# EAGLE design TindikSapi_V1_rev (EAGLE 9.6.2)
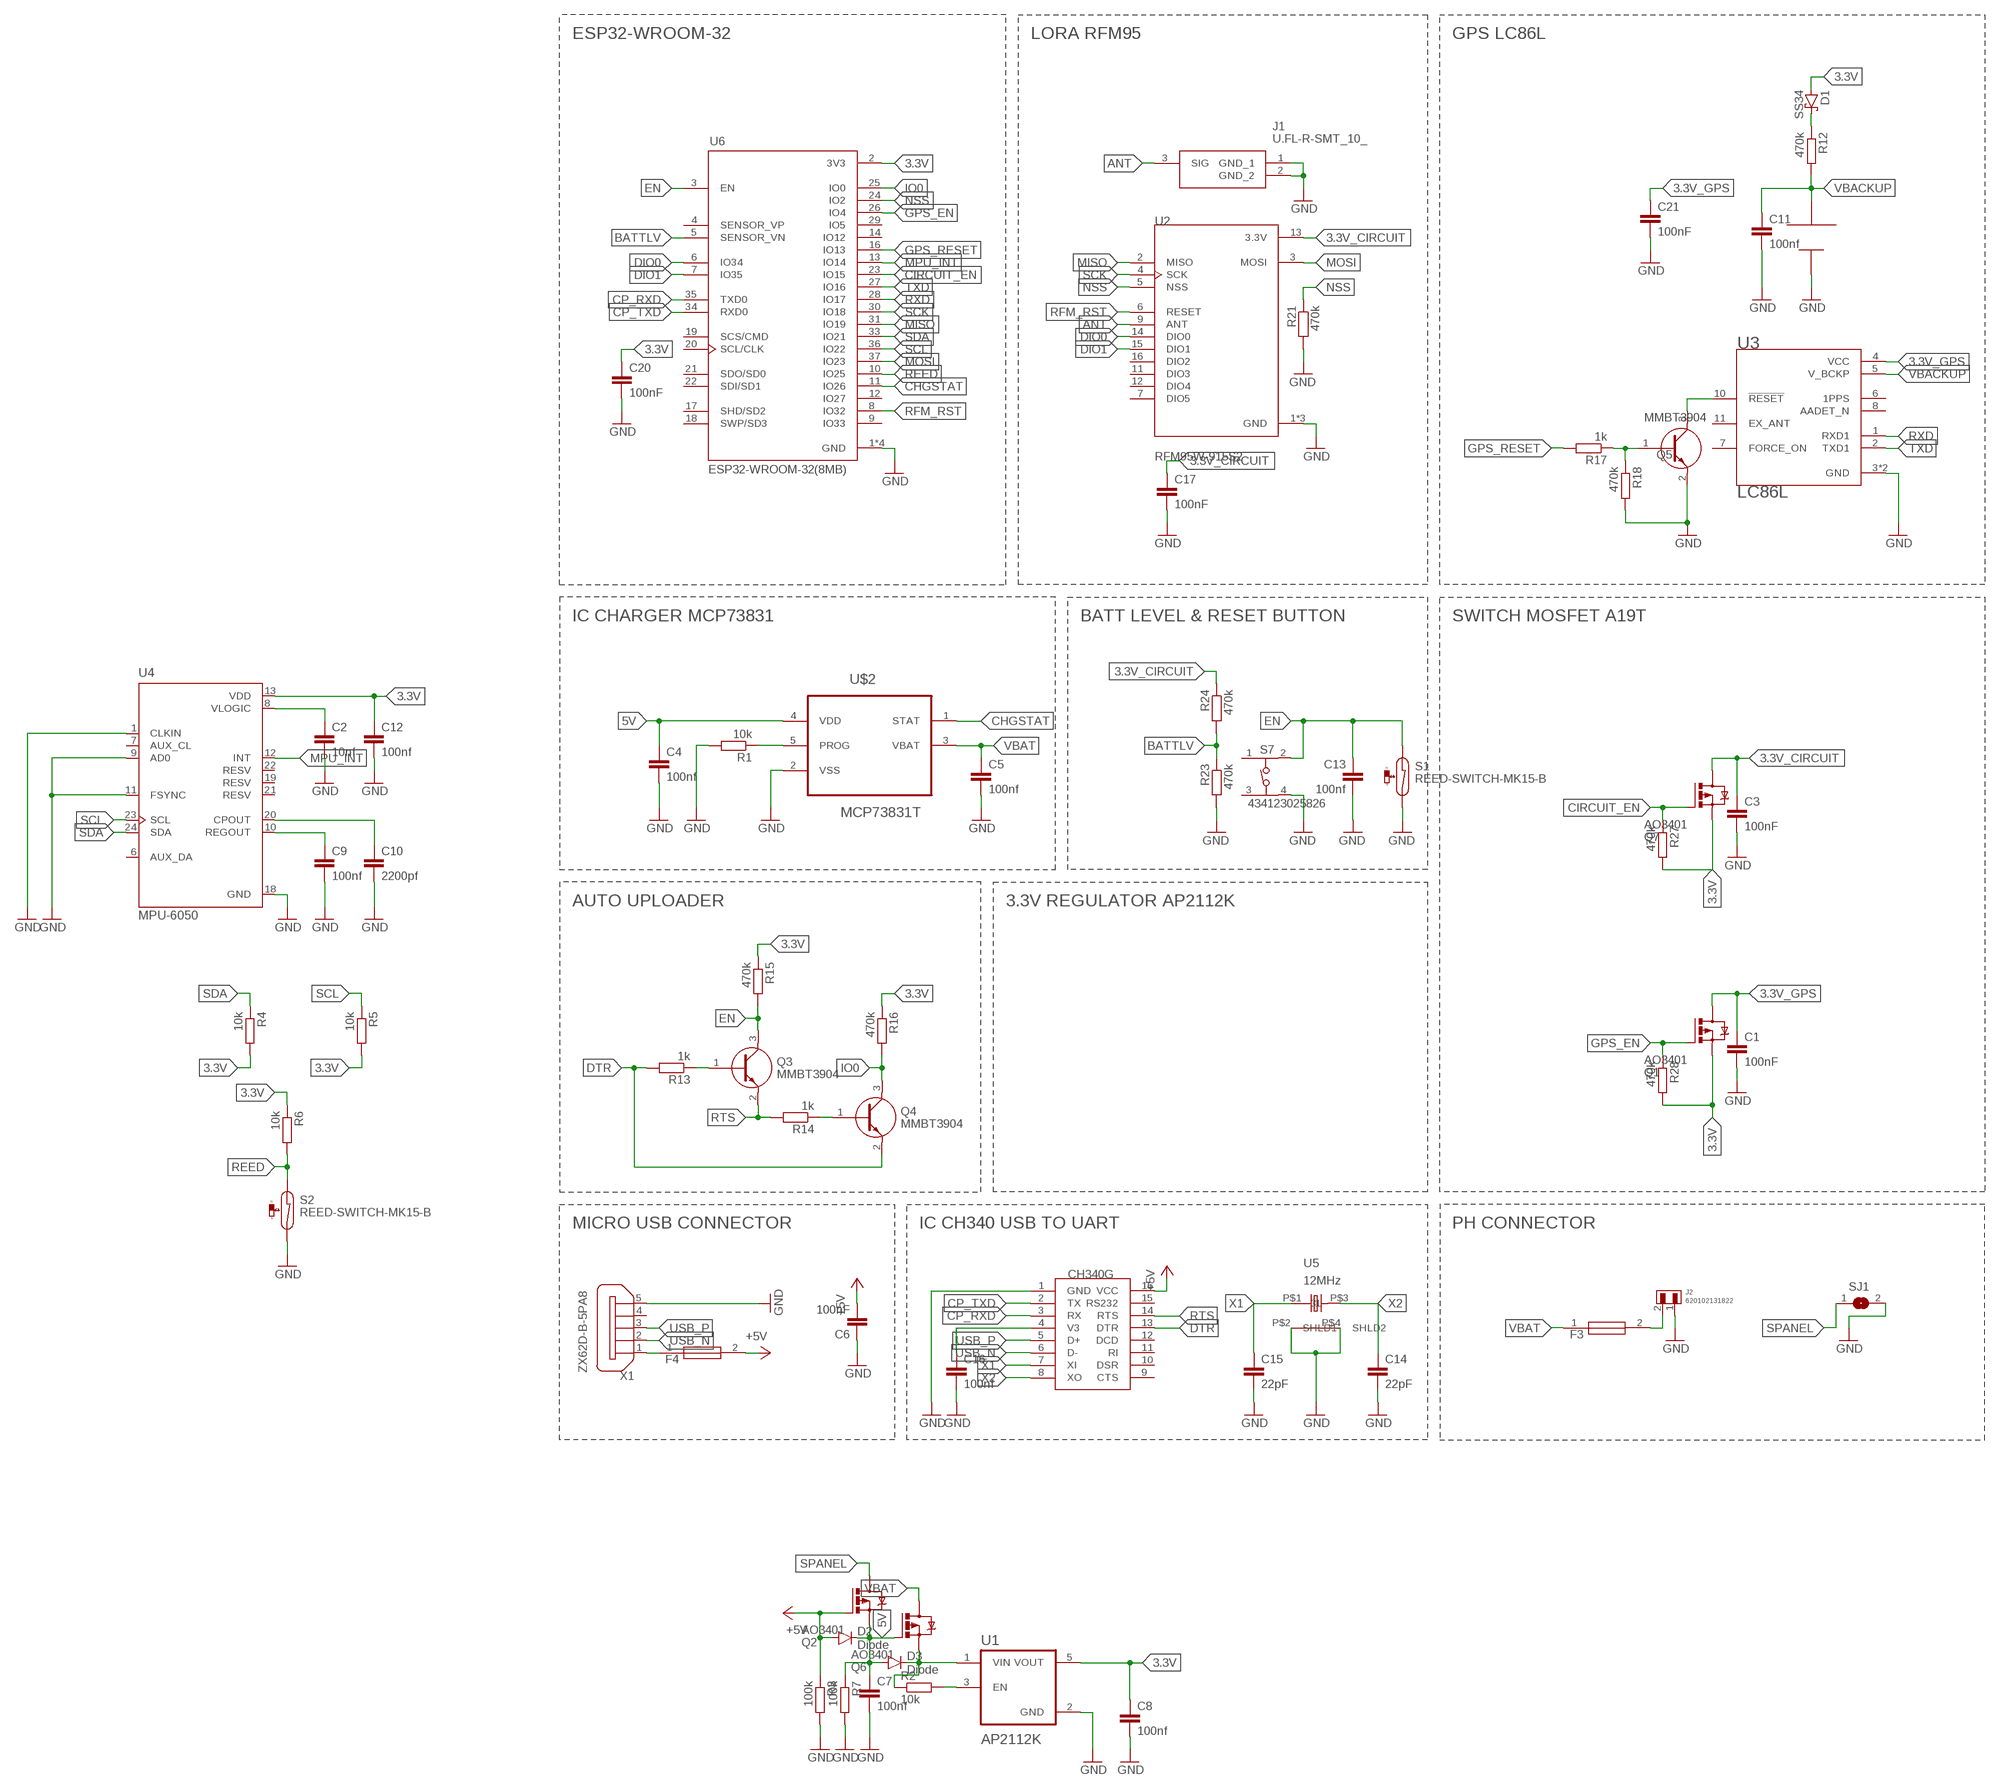
[diagram p0: schematic, sheet 1]

## Parts
C1  100nF  C-EUC0603  [C0603]
C2  10nf  C-EUC0603  [C0603]
C3  100nF  C-EUC0603  [C0603]
C4  100nf  C-EUC0603  [C0603]
C5  100nf  C-EUC0603  [C0603]
C6  100nF  C-EUC0603  [C0603]
C7  100nf  C-EUC0603  [C0603]
C8  100nf  C-EUC0603  [C0603]
C9  100nf  C-EUC0603  [C0603]
C10  2200pf  C-EUC0603  [C0603]
C11  100nf  C-EUC0603  [C0603]
C12  100nf  C-EUC0603  [C0603]
C13  100nf  C-EUC0603  [C0603]
C14  22pF  C-EUC0603  [C0603]
C15  22pF  C-EUC0603  [C0603]
C16  100nf  C-EUC0603  [C0603]
C17  100nF  C-EUC0603  [C0603]
C20  100nF  C-EUC0603  [C0603]
C21  100nF  C-EUC0603  [C0603]
D1  SS34  SS12  [SMA]
D2  Diode  DIODE-SOD123  [SOD123]
D3  Diode  DIODE-SOD123  [SOD123]
F3  FUSE 1A  MF-NSML260_12-2  [FUSC3216X100N]
F4  FUSE 1A  MF-NSML260_12-2  [FUSC3216X100N]
J1  U.FL-R-SMT_10_  [UFLRSMT10]
J2  620102131822  [620102131822]
Q1  AO3401  PMOSFET_SOT23  [SOT23]
Q2  AO3401  PMOSFET_SOT23  [SOT23]
Q3  MMBT3904  [SOT95P240X120-3N]
Q4  MMBT3904  [SOT95P240X120-3N]
Q5  MMBT3904  [SOT95P240X120-3N]
Q6  AO3401  PMOSFET_SOT23  [SOT23]
Q7  AO3401  PMOSFET_SOT23  [SOT23]
R1  10k  R-EU_R0603  [R0603]
R2  10k  R-EU_R0603  [R0603]
R3  100k  R-EU_R0603  [R0603]
R4  10k  R-EU_R0603  [R0603]
R5  10k  R-EU_R0603  [R0603]
R6  10k  R-EU_R0603  [R0603]
R7  100k  R-EU_R0603  [R0603]
R12  470k  R-EU_R0603  [R0603]
R13  1k  R-EU_R0603  [R0603]
R14  1k  R-EU_R0603  [R0603]
R15  470k  R-EU_R0603  [R0603]
R16  470k  R-EU_R0603  [R0603]
R17  1k  R-EU_R0603  [R0603]
R18  470k  R-EU_R0603  [R0603]
R21  470k  R-EU_R0603  [R0603]
R23  470k  R-EU_R0603  [R0603]
R24  470k  R-EU_R0603  [R0603]
R27  470k  R-EU_R0603  [R0603]
R28  470k  R-EU_R0603  [R0603]
S1  REED-SWITCH-MK15-B  [MK15]
S2  REED-SWITCH-MK15-B  [MK15]
S7  434123025826  [434123025826]
SJ1  SJW  [SJW]
U1  AP2112K  AP2112K-3.3TRG1  [SOT95P285X140-5N]
U2  RFM95W-915S2  [XCVR_RFM95W-915S2]
U3  LC86L  L86-M33  [XCVR_L86-M33]
U4  MPU-6050  [QFN50P400X400X95-24N]
U5  12MHz  NX3225SA  [NX32256A]
U6  ESP32-WROOM-32(8MB)  [MODULE_ESP32-WROOM-32(8MB)]
U$2  MCP73831T  MCP73831T-5ACI/OT  [SOT95P280X145-5N]
U$3  MS621FE  [MS621FE]
U$5  CH340G  CH340G-3D  [SOIC127P600X175-16N]
X1  ZX62D-B-5PA8  [ZX62D-B-5PA8]

## Nets
3.3V: C8.1 C12.1 C20.1 D1.A Q1.2(S) Q7.2(S) R4.2 R5.2 R6.1 R15.1 R16.1 R27.2 R28.2 U1.5(VOUT) U4.13(VDD) U6.2(3V3)
3.3V_CIRCUIT: C3.1 C17.1 Q7.3(D) R24.1 U2.13(3.3V)
3.3V_GPS: C1.1 C21.1 Q1.3(D) U3.4(VCC)
5V: C4.1 C7.1 D2.C D3.A Q2.2(S) Q6.1(G) R7.1 U$2.4(VDD)
+5V: C6.2 D2.A F4.2 Q2.1(G) R3.1 U$5.16(VCC)
ANT: J1.3(SIG) U2.9(ANT)
BATTLV: R23.1 R24.2 U6.5(SENSOR_VN)
CHGSTAT: U6.11(IO26) U$2.1(STAT)
CIRCUIT_EN: Q7.1(G) R27.1 U6.23(IO15)
CP_RXD: U6.35(TXD0) U$5.3(RX)
CP_TXD: U6.34(RXD0) U$5.2(TX)
DIO0: U2.14(DIO0) U6.6(IO34)
DIO1: U2.15(DIO1) U6.7(IO35)
DTR: Q4.2(E) R13.2 U$5.13(DTR)
EN: C13.1 Q3.3(C) R15.2 S1.1 S7.2 U6.3(EN)
GND: C1.2 C2.2 C3.2 C4.2 C5.2 C6.1 C7.2 C8.2 C9.2 C10.2 C11.2 C12.2 C13.2 C14.2 C15.2 C16.2 C17.2 C20.2 C21.2 J1.1(GND_1) J1.2(GND_2) J2.1 Q5.2(E) R1.2 R3.2 R7.2 R18.2 R21.2 R23.2 S1.2 S2.2 S7.4 SJ1.2 U1.2(GND) U2.1(GND) U2.8(GND) U2.10(GND) U3.3(GND) U3.12(GND) U4.1(CLKIN) U4.9(AD0) U4.11(FSYNC) U4.18(GND) U5.P$2(SHLD1) U5.P$4(SHLD2) U6.1(GND) U6.15(GND) U6.38(GND) U6.39(GND) U$2.2(VSS) U$3.V- U$5.1(GND) X1.5
GPS_EN: Q1.1(G) R28.1 U6.26(IO4)
GPS_RESET: R17.2 U6.16(IO13)
IO0: Q4.3(C) R16.2 U6.25(IO0)
MISO: U2.2(MISO) U6.31(IO19)
MOSI: U2.3(MOSI) U6.37(IO23)
MPU_INT: U4.12(INT) U6.13(IO14)
N$1: F4.1 X1.1
N$2: Q5.3(C) U3.10(!RESET)
N$3: Q3.1(B) R13.1
N$4: Q4.1(B) R14.1
N$5: D3.C Q6.2(S) R2.1 U1.1(VIN)
N$6: R1.1 U$2.5(PROG)
N$8: C2.1 U4.8(VLOGIC)
N$9: R2.2 U1.3(EN)
N$12: C9.1 U4.10(REGOUT)
N$14: C10.1 U4.20(CPOUT)
N$15: F3.2 J2.2
N$17: D1.C R12.1
N$18: Q5.1(B) R17.1 R18.1
N$27: C16.1 U$5.4(V3)
NSS: R21.1 U2.5(NSS) U6.24(IO2)
REED: R6.2 S2.1 U6.10(IO25)
RFM_RST: U2.6(RESET) U6.8(IO32)
RTS: Q3.2(E) R14.2 U$5.14(RTS)
RXD: U3.1(RXD1) U6.28(IO17)
SCK: U2.4(SCK) U6.30(IO18)
SCL: R5.1 U4.23(SCL) U6.36(IO22)
SDA: R4.1 U4.24(SDA) U6.33(IO21)
SPANEL: Q2.3(D) SJ1.1
TXD: U3.2(TXD1) U6.27(IO16)
USB_N: U$5.6(D-) X1.2
USB_P: U$5.5(D+) X1.3
VBACKUP: C11.1 R12.2 U3.5(V_BCKP) U$3.V+
VBAT: C5.1 F3.1 Q6.3(D) U$2.3(VBAT)
X1: C15.1 U5.P$1 U$5.7(XI)
X2: C14.1 U5.P$3 U$5.8(XO)
Unconnected: S7.1 S7.3 U2.7(DIO5) U2.11(DIO3) U2.12(DIO4) U2.16(DIO2) U3.6(1PPS) U3.7(FORCE_ON) U3.8(AADET_N) U3.11(EX_ANT) U4.6(AUX_DA) U4.7(AUX_CL) U4.19(RESV) U4.21(RESV) U4.22(RESV) U6.4(SENSOR_VP) U6.9(IO33) U6.12(IO27) U6.14(IO12) U6.17(SHD/SD2) U6.18(SWP/SD3) U6.19(SCS/CMD) U6.20(SCL/CLK) U6.21(SDO/SD0) U6.22(SDI/SD1) U6.29(IO5) U$5.9(CTS) U$5.10(DSR) U$5.11(RI) U$5.12(DCD) U$5.15(RS232) X1.4 X1.S1 X1.S2 X1.S3 X1.S4

## Notes on the sheet
- ESP32-WROOM-32 | LORA RFM95 | GPS LC86L
- IC CHARGER MCP73831 | BATT LEVEL & RESET BUTTON | SWITCH MOSFET A19T
- AUTO UPLOADER | 3.3V REGULATOR AP2112K
- MICRO USB CONNECTOR | IC CH340 USB TO UART | PH CONNECTOR

## Library data of the parts
C1-C17 C20 C21 = rcl:C-EU: CAPACITOR, European symbol; SPICEPREFIX: C
D1 = Diodes:SS12: DIODE SCHOTTKY 20V 1A SMA Manufacturer's datasheet <https://www.onsemi.com/pub/Collateral/SS19-D.PDF>; CREATED_BY: PCBLayout.com; DIGIKEY_PART_NUMBER: SS12FSCT-ND; MANUFACTURER: ON Semiconductor; MPN: SS12; PACKAGE: SMA (DO-214AC)
D2 D3 = diode:DIODE-: DIODE
F3 F4 = MF-NSML260_12-2:MF-NSML260_12-2: Resettable Fuses - PPTC 2.6A 12V 1206 LOW-OHMIC Source: Datasheet <https://www.bourns.com/docs/product-datasheets/mf-nsml-x.pdf>; ARROW_PART_NUMBER: MF-NSML260/12-2; ARROW_PRICE-STOCK: https://www.arrow.com/en/products/mf-nsml26012-2/bourns; DESCRIPTION: Resettable Fuses - PPTC 2.6A 12V 1206 LOW-OHMIC; HEIGHT: 1mm; MANUFACTURER_NAME: Bourns; MANUFACTURER_PART_NUMBER: MF-NSML260/12-2; MOUSER_PART_NUMBER: 652-MF-NSML260/12-2; MOUSER_PRICE-STOCK: https://www.mouser.com/Search/Refine.aspx?Keyword=652-MF-NSML260%2F12-2
J1 = U.FL-R-SMT_10_:U.FL-R-SMT_10_: RF Connectors / Coaxial Connectors U.FL RECEPTACLE SMT GLD M CONT REEL Source: Datasheet <https://media.digikey.com/pdf/Data Sheets/Hirose PDFs/UFL Series.pdf>; ARROW_PART_NUMBER: U.FL-R-SMT(10); ARROW_PRICE-STOCK: https://www.arrow.com/en/products/u.fl-r-smt-10/hirose-electric; DESCRIPTION: RF Connectors / Coaxial Connectors U.FL RECEPTACLE SMT GLD M CONT REEL; HEIGHT: 1.25mm; MANUFACTURER_NAME: Hirose; MANUFACTURER_PART_NUMBER: U.FL-R-SMT(10); MOUSER_PART_NUMBER: 798-U.FL-R-SMT10; MOUSER_PRICE-STOCK: https://www.mouser.co.uk/ProductDetail/Hirose-Connector/UFL-R-SMT10/?qs=Ux3WWAnHpjBT1CWD8UMEMQ%3D%3D
J2 = Wurth_Connectors_WR-WTB:620102131822: WR-WTB 2.00 mm SMT Male Horizontal Shrouded Header KIND PROPERTIES: Pitch:2 mm Gender:Male MATERIAL PROPERTIES: Insulator Material :PA9T Insulator Flammability Rating:UL94 V-0 Color:Beige Contact Material:Copper Alloy Contact Plating:Tin Contact Type:Stamped GENERAL INFORMATION Operating Temperature:-25 up to +85 °C Compliance: RoHS Working Voltage:100 V (AC) Withstanding Voltage:800V (AC) Contact Resistance:20 mΩ RISO:1000 MΩ CERTIFICATION UL Approval:E323964 PACKAGING PROPERTIES Packaging:Tape and Reel <https://katalog.we-online.com/media/images/v2/o33353v209%20Family_WR-WTB_6201xx131822.jpg> Details see: https://katalog.we-online.com/en/em/WTB_2_00_SMT_MALE_HORIZONTAL_SHROUDED_HEADER_6201XX131822 Updated by Yingchun,Shan 2019-11-08 2019 (C) Würth Elektronik; CONTACT-RESISTANCE: 20mOhm; DATASHEET-URL: https://www.we-online.com/catalog/datasheet/620102131822.pdf; GENDER: Male; IR: 2A; L: 8mm; MOUNT: SMT; PACKAGING: Tape and Reel; PART-NUMBER: 620102131822; PCB-CABLE-PANEL: PCB; PINS: 2; PITCH: 2mm; TOL-R: max.; TYPE: Horizontal; USE-WITH: WR-WTB 2.00 mm Female Terminal Housing; WORKING-VOLTAGE: 100V(AC)
Q1 Q2 Q6 Q7 = Transistor:PMOSFET: P-Channel MOSFET - Generic; CATEGORY: Transistor; SUB-CATEGORY: MOSFET; TYPE: P-Channel; VALUE: PMOSFET
Q3-Q5 = MMBT3904:MMBT3904: Transistor GP BJT NPN 40V 0.2A SOT23 Fairchild MMBT3904 NPN Bipolar Transistor, 0.2 A, 40 V, 3-Pin SOT-23 Source: Datasheet <https://media.digikey.com/pdf/Data Sheets/ON Semiconductor PDFs/2N3904,MMBT3904,PZT3904.pdf>; ARROW_PART_NUMBER: MMBT3904; ARROW_PRICE-STOCK: https://www.arrow.com/en/products/mmbt3904/on-semiconductor; DESCRIPTION: Transistor GP BJT NPN 40V 0.2A SOT23 Fairchild MMBT3904 NPN Bipolar Transistor, 0.2 A, 40 V, 3-Pin SOT-23; HEIGHT: 1.2mm; MANUFACTURER_NAME: ON Semiconductor; MANUFACTURER_PART_NUMBER: MMBT3904; MOUSER_PART_NUMBER: 512-MMBT3904; MOUSER_PRICE-STOCK: https://www.mouser.co.uk/ProductDetail/ON-Semiconductor-Fairchild/MMBT3904?qs=UMEuL5FsraCg3xKjS4uBJQ%3D%3D
R1-R7 R12-R18 R21 R23 R24 R27 R28 = rcl:R-EU_: RESISTOR, European symbol; SPICEPREFIX: R
S1 S2 = switch-reed:REED-SWITCH-: Reed Sensor; MF: MEDER; MPN: MK15-B-2; OC_FARNELL: 1079484
S7 = Wurth_Switch_WS-TASV:434123025826: WS-TASV J-Bend SMT Tact Switch 4.2x3.2 mm MATERIAL PROPERTIES Cover Material Stainless Steel PROPERTIES Actuator Material LCP Actuator Flammability Rating UL94 V-0 Actuator Color Black; White Frame Material LCP Frame Flammability Rating UL94 V-0 Frame Color Black Contact Material Stainless Steel Contact Plating Silver Terminal Material Copper Alloy Terminal Plating Silver VR 16 V (DC) Contact Resistance Initial 500 mΩ Contact Resistance After Life Test 1 Ω RISO 100 MΩ Withstanding Voltage 250 V (AC) Qty. 2900 Mechanical Properties Stroke 0.2 mm GENERAL INFORMATION Operating Temperature -40 up to +85 °C PACKAGING PROPERTIES Packaging Tape and Reel <https://www.we-online.com/catalog/media/o106805v209%20Family_WS-TASV-4341x30258x6_Gruppe.jpg> Details see: https://www.we-online.com/catalog/en/TASV_4_2X3_2_SMD_J-BEND/ Created by Yingchun,Shan 2020-02-20 2020(C) Wurth Elektronik; DATASHEET-URL: https://www.we-online.com/catalog/datasheet/434123025826.pdf; H: 2.5mm; OPERATION-FORCE: 260g; PART-NUMBER: 434123025826; QTY: 2900
SJ1 = jumper:SJ: SMD solder JUMPER
U1 = AP2112K-3.3TRG1:AP2112K-3.3TRG1: AP2112 Series 0.6 A 3.3 V Fixed Output SMT LDO Linear Regulator - SOT23-5; AVAILABILITY: Unavailable; DESCRIPTION: Linear Voltage Regulator IC 1 Output 600mA SOT-25; MF: Diodes Inc.; MP: AP2112K-3.3TRG1; PACKAGE: SOT-753 Diodes Inc.; PRICE: None
U2 = RFM95W-915S2:RFM95W-915S2: RFM95(W) - Low Power Long Range Transceiver Module V1.0; AVAILABILITY: Unavailable; DESCRIPTION: General ISM < 1GHz LoRa™ Transceiver Module 915MHz Surface Mount; MF: RF Solutions; MP: RFM95W-915S2; PACKAGE: SMD-16 RF Solutions; PRICE: None
U3 = L86-M33:L86-M33: L86 is an ultra-compact GNSS POT (Patch on Top) module with an embedded 18.4mm × 18.4mm × 4.0mm patch antenna and utilizes the MediaTek new generation GNSS chipset MT3333 that achieves the perfect performance Check prices <https://pricing.snapeda.com/parts/L86-M33/Quectel/view-part?ref=eda>; AVAILABILITY: Warning; DESCRIPTION: L86 is an ultra-compact GNSS POT (Patch on Top) module with an embedded 18.4mm × 18.4mm × 4.0mm patch antenna and utilizes the MediaTek new generation GNSS chipset MT3333 that achieves the perfect performance; MF: Quectel; MP: L86-M33; PACKAGE: LCC-12 Quectel; PRICE: None; PURCHASE-URL: https://pricing.snapeda.com/search/part/L86-M33/?ref=eda
U4 = MPU-6050:MPU-6050: MPU-6050 Six-Axis (Gyro + Accelerometer) MEMS MotionTracking™ Devices Check prices <https://pricing.snapeda.com/parts/MPU-6050/TDK%20InvenSense/view-part?ref=eda>; AVAILABILITY: In Stock; DESCRIPTION: Accelerometer, Gyroscope, 6 Axis Sensor I²C Output; MF: TDK InvenSense; MP: MPU-6050; PACKAGE: VFQFN-24 TDK InvenSense; PRICE: None; PURCHASE-URL: https://pricing.snapeda.com/search/part/MPU-6050/?ref=eda
U5 = NX3225SA:NX3225SA: SMD crystal; AVAILABILITY: Unavailable; DESCRIPTION: 12MHz ±15ppm Crystal 8pF 100 Ohms 4-SMD, No Lead; MF: NDK America,; MP: NX3225SA; PACKAGE: SMD-4 NDK America,; PRICE: None
U6 = ESP32-WROOM-32_8MB_:ESP32-WROOM-32(8MB): WIFI MODULE 64 MBITS SPI FLASH; AVAILABILITY: Unavailable; DESCRIPTION: Bluetooth, WiFi 802.11b/g/n, Bluetooth v4.2 +EDR, Class 1, 2 and 3 Transceiver Module 2.4GHz ~ 2.5GHz Surface Mount; MF: Espressif Systems; MP: ESP32-WROOM-32 (8MB); PACKAGE: Module Espressif Systems; PRICE: None
U$2 = MCP73831T-5ACI_OT:MCP73831T-5ACI/OT: Charge Management Controller Check prices <https://pricing.snapeda.com/parts/MCP73831T-5ACI/OT/Microchip/view-part?ref=eda>; AVAILABILITY: Good; DESCRIPTION: Charger IC Lithium Ion/Polymer SOT-23-5; MF: Microchip; MP: MCP73831T-5ACI/OT; PACKAGE: SOT-23-5 Microchip; PRICE: None; PURCHASE-URL: https://pricing.snapeda.com/search/part/MCP73831T-5ACI/OT/?ref=eda
U$3 = MS621FE:MS621FE
U$5 = ch340g:CH340G-3D
X1 = microusb 5p:ZX62D-B-5PA8: Micro USB Type B Connector - Standard, Shell Through Hole Source: http://www.hirose.co.jp/cataloge_hp/ed_ZX_20140804.pdf; MF: Hirose; MPN: ZX62D-B-5PA8; OC_FARNELL: 2300438; OC_NEWARK: 69W0712

## Board
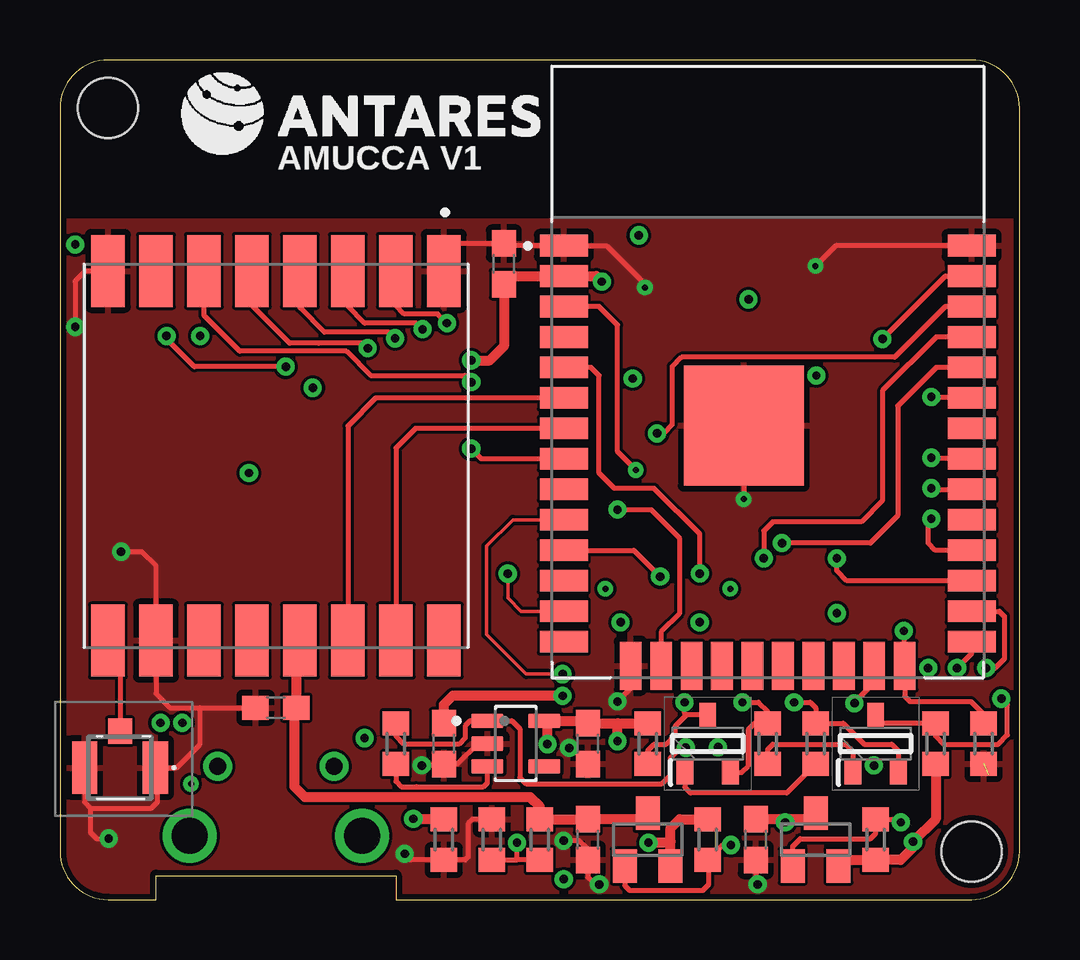
[diagram p1: board, top side]
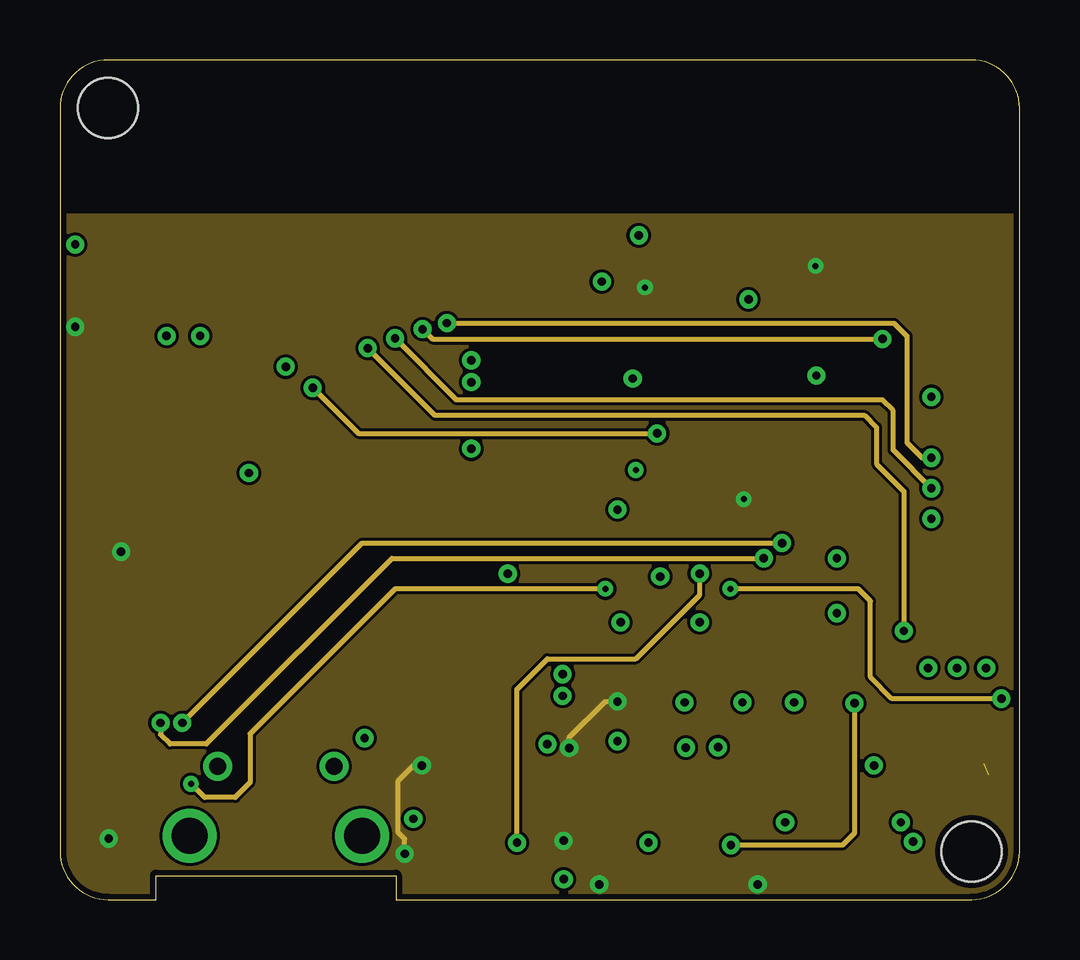
[diagram p2: board, inner layer Route2]
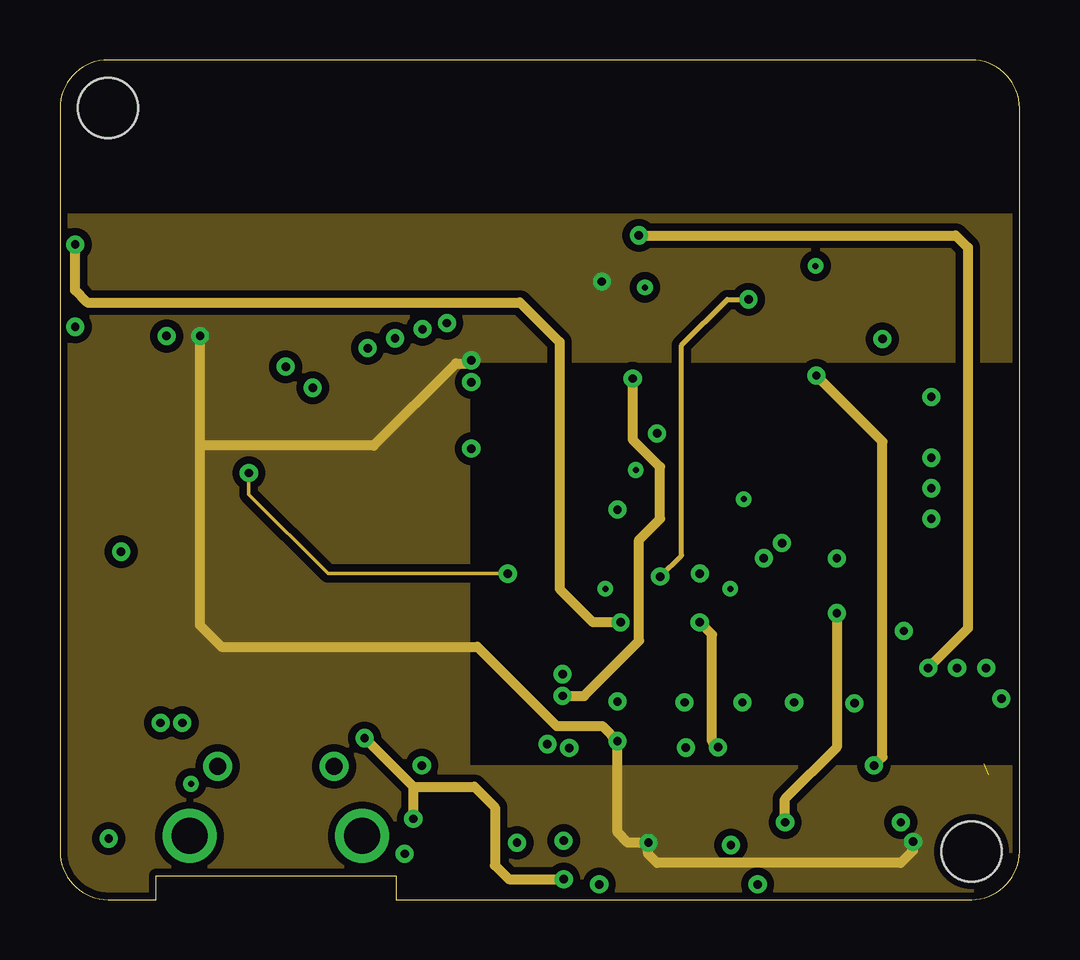
[diagram p3: board, inner layer Route15]
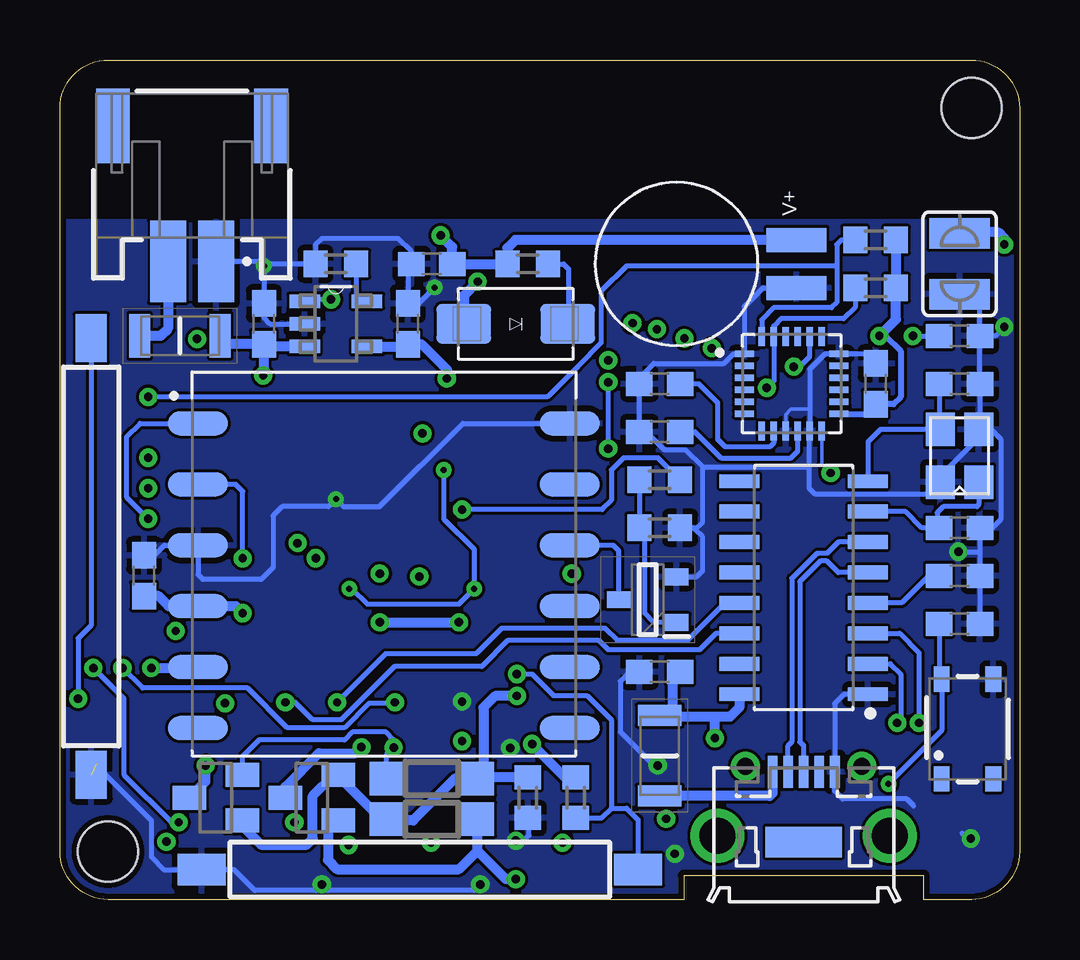
[diagram p4: board, bottom side, seen from below]

Size 40 x 35 mm. Coordinates in mm from the lower left corner, seen from the top.
Outline: 40,2 40,33 arc90 38,35 2,35 arc90 0,33 0,2 arc90 2,0 4,0 4,1 14,1 14,0 38,0 arc90 40,2
Copper layers (1+2*15+16): Top 0.035mm / dielectric 0.2mm / Route2 0.0175mm / dielectric 0.665mm / Route15 0.0175mm / dielectric 0.2mm / Bottom 0.035mm
Design rules "default *": minimum track width 5mil, minimum drill 0.25mm, track to track 5mil, track to pad 6mil, pad to pad 6mil, via to via 6mil, smd to smd 6mil, copper to edge 10mil, drill to drill 6mil, minimum pad ring 10mil, minimum via ring 8mil, stop-mask expansion 4mil, vias tented up to drill 25mil, thermal gap 10mil
Holes 2.5 mm at 38,2 2,33
tRestrict: 4 lines
bRestrict: 4 lines
vRestrict: 4 lines

### Footprints (pad centres in the part's own frame; a part is rotated, then mirrored left to right if it is on the bottom)
C0603 = smd 1.1 x 1: 1 -0.85,0; 2 0.85,0
SMA = smd 2.28 x 1.66: A 2.165,0; C -2.165,0
SOD123 = smd 1.4 x 1.4: A 1.9,0; C -1.9,0
FUSC3216X100N = smd 0.86 x 1.82: 1 -1.675,0; 2 1.675,0
UFLRSMT10 = smd 1.05 x 2.2: 1 -1.475,0; 2 1.475,0 | smd 1 x 1.05: 3 0,-1.525
620102131822 = smd 1.5 x 3.4: 1 -1,2.9; 2 1,2.9 | smd 1.4 x 3.1: Z1 -3.3,-2.75; Z2 3.3,-2.75
SOT23 = smd 1 x 1.4: 1 -0.95,-1.1; 2 0.95,-1.1; 3 0,1.1
SOT95P240X120-3N = smd 1 x 0.7: 1 -1.2,0.95; 2 -1.2,-0.95; 3 1.2,0
R0603 = smd 1 x 1.1: 1 -0.85,0; 2 0.85,0
MK15 = smd 2 x 1.3: 1 -9.1,0; 2 9.1,0
434123025826 = smd 1.05 x 0.65: 1 -2.075,1.075; 2 2.075,1.075; 3 -2.075,-1.075; 4 2.075,-1.075
SJW = smd 1.27 x 2.54: 1 -1.27,0; 2 1.27,0
SOT95P285X140-5N = smd 1.35 x 0.6: 1 -1.185,0.95; 2 -1.185,0; 3 -1.185,-0.95; 4 1.185,-0.95; 5 1.185,0.95
XCVR_RFM95W-915S2 = smd 3 x 1.4: 1 -7.7,7; 2 -7.7,5; 3 -7.7,3; 4 -7.7,1; 5 -7.7,-1; 6 -7.7,-3; 7 -7.7,-5; 8 -7.7,-7; 9 7.7,-7; 10 7.7,-5; 11 7.7,-3; 12 7.7,-1; 13 7.7,1; 14 7.7,3; 15 7.7,5; 16 7.7,7
XCVR_L86-M33 = smd 2.5 x 1: 1 -7.75,6.35; 2 -7.75,3.81; 3 -7.75,1.27; 4 -7.75,-1.27; 5 -7.75,-3.81; 6 -7.75,-6.35; 7 7.75,-6.35; 8 7.75,-3.81; 9 7.75,-1.27; 10 7.75,1.27; 11 7.75,3.81; 12 7.75,6.35
QFN50P400X400X95-24N = smd 0.79 x 0.26: 1 -1.97,1.25; 2 -1.97,0.75; 3 -1.97,0.25; 4 -1.97,-0.25; 5 -1.97,-0.75; 6 -1.97,-1.25; 13 1.97,-1.25; 14 1.97,-0.75; 15 1.97,-0.25; 16 1.97,0.25; 17 1.97,0.75; 18 1.97,1.25 | smd 0.26 x 0.79: 7 -1.25,-1.97; 8 -0.75,-1.97; 9 -0.25,-1.97; 10 0.25,-1.97; 11 0.75,-1.97; 12 1.25,-1.97; 19 1.25,1.97; 20 0.75,1.97; 21 0.25,1.97; 22 -0.25,1.97; 23 -0.75,1.97; 24 -1.25,1.97
NX32256A = smd 1.4 x 1.2: P$1 -1.1,-0.8; P$2 1.1,-0.8; P$3 1.1,0.8; P$4 -1.1,0.8
MODULE_ESP32-WROOM-32(8MB) = smd 2 x 0.9: 1 -8.5,5.26; 2 -8.5,3.99; 3 -8.5,2.72; 4 -8.5,1.45; 5 -8.5,0.18; 6 -8.5,-1.09; 7 -8.5,-2.36; 8 -8.5,-3.63; 9 -8.5,-4.9; 10 -8.5,-6.17; 11 -8.5,-7.44; 12 -8.5,-8.71; 13 -8.5,-9.98; 14 -8.5,-11.25; 25 8.5,-11.25; 26 8.5,-9.98; 27 8.5,-8.71; 28 8.5,-7.44; 29 8.5,-6.17; 30 8.5,-4.9; 31 8.5,-3.63; 32 8.5,-2.36; 33 8.5,-1.09; 34 8.5,0.18; 35 8.5,1.45; 36 8.5,2.72; 37 8.5,3.99; 38 8.5,5.26 | smd 0.9 x 2: 15 -5.715,-12.25; 16 -4.445,-12.25; 17 -3.175,-12.25; 18 -1.905,-12.25; 19 -0.635,-12.25; 20 0.635,-12.25; 21 1.905,-12.25; 22 3.175,-12.25; 23 4.445,-12.25; 24 5.715,-12.25 | smd 5 x 5: 39 -1,-2.24
SOT95P280X145-5N = smd 1.27 x 0.559: 1 -1.295,0.94; 2 -1.295,0; 3 -1.295,-0.94; 4 1.295,-0.94; 5 1.295,0.94
MS621FE = smd 1 x 2.5: V+ 1,-1.2; V- -1,-1.2
SOIC127P600X175-16N = smd 1.655 x 0.568: 1 -2.678,4.445; 2 -2.678,3.175; 3 -2.678,1.905; 4 -2.678,0.635; 5 -2.678,-0.635; 6 -2.678,-1.905; 7 -2.678,-3.175; 8 -2.678,-4.445; 9 2.678,-4.445; 10 2.678,-3.175; 11 2.678,-1.905; 12 2.678,-0.635; 13 2.678,0.635; 14 2.678,1.905; 15 2.678,3.175; 16 2.678,4.445
ZX62D-B-5PA8 = smd 1.35 x 0.4: 1 4.825,1.3; 2 4.825,0.65; 3 4.825,0; 4 4.825,-0.65; 5 4.825,-1.3 | smd 1.27 x 3.175: P$1 1.905,0 | drill 1.5: S1 2.15,-3.6; S2 2.15,3.6 | drill 0.7: S3 5.05,2.425; S4 5.05,-2.425

### Placement (x,y rotation side)
C1  29,2.5 270 top
C2  15,21.5 180 bottom
C3  22,2.5 270 top
C4  25.5,24 90 bottom
C5  31.5,24 90 bottom
C6  15,9.5 0 bottom
C7  16,6.5 270 top
C8  22,6.5 270 top
C9  15,19.5 180 bottom
C10  2.5,23.5 0 bottom
C11  24.5,26.5 180 bottom
C12  6,21.5 90 bottom
C13  2.5,11.5 0 bottom
C14  2.5,21.5 0 bottom
C15  2.5,15.5 0 bottom
C16  2.5,13.5 0 bottom
C17  9,8 180 top
C20  18.5,26.5 90 top
C21  36.5,13.5 90 bottom
D1  21,24 180 bottom
D2  24.5,3.35 0 bottom
D3  24.5,5.05 0 bottom
F3  35,23.5 180 bottom
F4  15,6 90 bottom
J1  2.5,5.5 180 top
J2  34.5,29.5 180 bottom
Q1  31.5,2.5 0 top
Q2  29.5,4.25 90 bottom
Q3  34,6.5 90 top
Q4  27,6.5 90 top
Q5  15.5,12.5 180 bottom
Q6  33.5,4.25 90 bottom
Q7  24.5,2.5 0 top
R1  28.5,26.5 180 bottom
R2  14,6.5 270 top
R3  16,2.5 270 top
R4  6,27.5 0 bottom
R5  6,25.5 0 bottom
R6  18.5,4.25 270 bottom
R7  20.5,4.25 270 bottom
R12  20.5,26.5 180 bottom
R13  29.5,6.5 90 top
R14  31.5,6.5 90 top
R15  36.5,6.5 90 top
R16  24.5,6.5 270 top
R17  15,17.5 0 bottom
R18  15,15.5 0 bottom
R21  38.5,6.5 270 top
R23  18,2.5 90 top
R24  20,2.5 270 top
R27  27,2.5 90 top
R28  34,2.5 270 top
S1  38.7,14.3 270 bottom
S2  25,1.25 180 bottom
S7  2.17,7.11 90 bottom
SJ1  2.5,26.5 270 bottom
U1  19,6.5 0 top
U2  9,18.5 270 top
U3  26.5,13.5 0 bottom
U4  9.5,21.5 0 bottom
U5  2.5,18.5 90 bottom
U6  29.5,22 0 top
U$2  28.5,24 0 bottom
U$3  10.5,26.5 90 bottom
U$5  9,13 180 bottom
X1  9,0.5 90 bottom

### Tracks (layer width: path | path; a pad name or v marks a point on that pad's centre or on a via)
3.3V  (via drill 0.35)
  Top 0.406: Q1.2 32.7,1.65 R28.2 35.05,1.65 35.56,2.16 v35.56,2.41 36.5,3.35 R15.1 | Q7.2 25.45,2.41 | 25.45,2.41 25.45,2.97 25.83,3.35 R27.2 | v22.59,25.76 22.36,25.99 U6.2 18.84,25.99 C20.1 18.5,23.07 17.91,22.48 v17.14,22.48 | 23.24,7.35 C8.1 21.9,7.45 U1.5 20.32,7.32 v20.32,6.48 | 23.24,7.35 R16.1 | 25.45,2.41 25.41,2.37 v24.53,2.37 | v23.24,6.6 23.24,7.35
  Route15 0.406: v35.56,2.41 35.56,2.03 35.05,1.52 24.89,1.52 24.51,1.91 24.51,2.35 v24.53,2.37 23.67,2.37 23.24,2.79 v23.24,6.6 22.61,7.24 20.7,7.24 17.4,10.54 6.73,10.54 5.84,11.43 5.84,18.92 | v17.14,22.48 17.02,22.35 16.51,22.35 13.08,18.92 5.84,18.92 | 5.84,18.92 v5.84,23.5
  Bottom 0.254: U4.13 6.4,20.25 C12.1 5.26,20.65 4.95,20.95 4.95,22.86 5.59,23.5 v5.84,23.5
  Bottom 0.406: v22.59,25.76 23.16,25.18 D1.A | R4.2 R5.2 5.15,24.19 v5.84,23.5 | R6.1 18.94,5.1 v20.32,6.48
  pour Route15 (isolate 0.305): 0,0 40,0 40,5.5 17.5,5.5 17,5.5 17,22.5 40,22.5 40,23 40,28.5 39,28.5 0,28.5
3.3V_CIRCUIT
  Top 0.406: Q7.3 24.25,3.35 C3.1 R24.1 20,3.88 19.61,4.27 10.21,4.27 9.78,4.7 9.78,7.93 C17.1 9.85,10.65 U2.13
3.3V_GPS  (via drill 0.35)
  Top 0.406: Q1.3 31.25,3.35 30.23,3.35 | 30.23,3.35 C1.1 | 30.23,3.35 v30.23,3.22
  Route15 0.406: v32.38,11.94 32.38,6.35 30.23,4.19 v30.23,3.22
  Bottom 0.406: C21.1 35.89,12.65 35.47,12.23 U3.4 32.68,12.23 v32.38,11.94
5V  (via drill 0.35)
  Top 0.203: 16.1,7.45 C7.1
  Top 0.406: C7.1 16,8.13 16.38,8.51 20.93,8.51 v20.95,8.49
  Route15 0.406: v23.87,21.72 23.87,19.18 25.02,18.03 25.02,15.88 24.14,15 24.14,10.79 21.84,8.49 v20.95,8.49
  Bottom 0.203: 28.01,5.59 Q2.2
  Bottom 0.406: R7.1 22.35,5.1 | 22.35,5.1 22.55,5.1 D3.A 23.52,5.05 25.27,3.3 26.35,3.3 D2.C 26.6,3.35 28.4,5.15 Q2.2 28.57,5.21 29.46,4.32 29.46,2.54 29.72,2.29 31.62,2.29 32.4,3.06 Q6.1 | U$2.4 25.59,23.06 C4.1 24.93,23.15 23.87,22.09 v23.87,21.72 | v20.95,8.49 21.86,8.49 22.35,8 22.35,5.1
+5V  (via drill 0.35)
  Top 0.406: R3.1 14.75,3.35 v14.73,3.36
  Route15 0.406: v12.7,6.73 14.73,4.7 | 14.73,4.7 17.27,4.7 18.13,3.84 18.13,1.43 18.71,0.85 v21,0.85 | v14.73,3.36 14.73,4.7
  Bottom 0.406: U$5.16 11.68,8.01 12.06,7.62 12.7,7.62 | 12.7,7.62 14.48,7.62 | 14.48,7.62 14.95,7.62 F4.2 | C6.2 14.48,9.17 14.48,7.62 | v12.7,6.73 12.7,7.62 | Q2.1 28.83,2.87 28.83,1.65 28.45,1.27 23.37,1.27 22.6,2.04 | 22.6,2.04 D2.A | v21,0.85 21.41,0.85 22.6,2.04
ANT
  Top 0.213: U2.9 2.5,10.3 J1.3
BATTLV  (via drill 0.35)
  Top 0.203: R24.2 19.05,1.65 | R23.1 19.05,1.65 | 19.05,1.65 v19.05,2.37 | v26.67,13.59 26.67,15.24 24.77,17.14 23.11,17.14 22.48,17.78 22.48,21.84 22.14,22.18 U6.5
  Route2 0.203: v19.05,2.37 19.05,8.76 20.32,10.03 24,10.03 26.67,12.7 v26.67,13.59
CHGSTAT  (via drill 0.35)
  Top 0.203: U6.11 23.92,14.56 v25.02,13.46
  Route15 0.203: v25.02,13.46 25.91,14.35 25.91,23.11 27.81,25.02 v28.7,25.02
  Bottom 0.203: v28.7,25.02 29.72,25.02 U$2.1
CIRCUIT_EN  (via drill 0.35)
  Top 0.203: Q7.1 23.55,0.58 23.75,0.38 26.8,0.38 27.05,0.64 27.05,1.6 R27.1 27.62,2.27 v27.97,2.27 | U6.23 33.95,9.05 33.12,8.23 v33.12,8.18
  Route2 0.203: v33.12,8.18 33.12,2.77 32.62,2.27 v27.97,2.27
CP_RXD  (via drill 0.35)
  Top 0.203: U6.35 36.53,23.45 34.29,21.21 34.29,16.64 33.4,15.75 29.72,15.75 29.34,15.37 v29.34,14.23
  Route2 0.203: v4.19,7.37 4.19,6.87 4.58,6.48 6.1,6.48 13.84,14.22 v29.33,14.22 v29.34,14.23
  Bottom 0.203: U$5.3 5,11.1 4.19,10.29 v4.19,7.37
CP_TXD  (via drill 0.35)
  Top 0.203: U6.34 36.53,22.18 34.92,20.57 34.92,16 33.78,14.86 v30.1,14.86
  Route2 0.203: v5.1,7.37 12.59,14.86 v30.1,14.86
  Bottom 0.203: U$5.2 5.38,9.82 4.95,9.4 4.95,7.51 v5.1,7.37
DIO0
  Top 0.203: U6.6 13.16,20.91 12,19.75 U2.14
DIO1
  Top 0.203: U6.7 14.81,19.64 14,18.83 U2.15
DTR  (via drill 0.35)
  Top 0.203: v28.45,8.22 29.12,8.22 29.5,7.84 R13.2 28.96,7.35 28.7,7.1 28.7,6.26 28.7,6.25 28.7,5.58 28.41,5.3 Q4.2
  Bottom 0.203: U$5.13 12.27,12.37 13.84,10.79 16.76,10.79 17.27,11.3 21.59,11.3 22.64,10.25 26.42,10.25 v28.45,8.22
EN  (via drill 0.25, 0.35)
  Top 0.203: Q3.3 34.35,7.35 R15.2 36.5,6.81 36.83,6.48 39.12,6.48 39.5,6.86 39.5,8.12 v39.24,8.37 | U6.3 22.48,24.72 23.24,23.96 23.24,18.67 v24,17.91
  Route2 0.203: v22.73,12.95 13.97,12.95 7.93,6.91 7.93,4.88 7.3,4.25 6.03,4.25 v5.46,4.83 | v39.24,8.37 34.68,8.37 33.78,9.27 33.78,12.45 33.27,12.95 v27.94,12.95
  Bottom 0.203: S1.1 38.7,11.43 39.24,10.89 v39.24,8.37 | v24,17.91 24,15.88 22.73,14.61 v22.73,12.95 23.37,12.32 27.18,12.32 27.81,12.95 v27.94,12.95 | 3.2,9.14 S7.2 | S7.2 3.35,9.29 C13.1 | S7.2 3.24,7.04 v5.46,4.83
GND  (via drill 0.25, 0.35)  (1 unrouted)
  Top 0.203: J1.2 1.02,4.05 1.27,3.81 | 1.27,3.81 3.81,3.81 4.06,4.06 4.06,5.41 J1.1 4.87,5.5 5.84,6.48 5.84,8 | 1.27,3.81 1.27,2.79 1.52,2.54 v2.03,2.54 | C1.2 29,0.71 v29.08,0.63 | 5.84,8 4.57,8 4,8.57 U2.10 4,13.91 3.41,14.5 v2.55,14.5 | 5.84,8 C17.2 | U2.8 1.05,26.2 0.64,25.78 v0.64,23.88 | R23.2 17.19,3.35 17.02,3.17 17.02,1.78 16.89,1.65 R3.2 14.62,1.65 v14.37,1.91 | v22.48,0.63 22.29,0.63 22,0.92 C3.2 22,2.08 21.63,2.45 v21,2.45 | U6.38 32.34,27.26 v31.5,26.42 | v24.38,25.52 24.38,25.65 22.78,27.26 U6.1 18.59,27.26 C20.2 16.43,27.35 16,26.92 U2.1 | U6.39 v28.5,16.69 | U1.2 17.42,6.5 16.57,5.65 C7.2 15.94,5.59 v15.08,5.59 | U6.15 23.79,8.8 v23.24,8.26 | C8.2 21.33,6.32 v21.23,6.32
  Route2 0.203: v14.37,1.91 14.37,2.52 14.1,2.79 14.1,4.95 14.73,5.59 v15.08,5.59 | v21.23,6.32 21.23,6.75 22.73,8.26 v23.24,8.26
  Bottom 0.152: U4.9 9.75,20.22 9.53,20.45 8.75,20.45
  Bottom 0.203: U5.P$2 1.7,19.25 3.3,17.66 U5.P$4 3.81,16.89 8.51,16.89 8.76,17.14 8.76,18.03 | C10.2 C14.2 1.65,19.65 U5.P$2 | 6.38,22.73 C12.2 6.4,22.75 U4.18 8.11,22.75 8.75,22.11 8.75,20.45 U4.11 8.76,19.52 8.76,18.03 | 1.65,14.48 C15.2 1.14,15.5 0.76,15.88 0.76,19.18 1.19,19.6 U5.P$2 | 1.65,14.48 C16.2 C13.2 | C10.2 1.65,24.76 2.12,25.23 SJ1.2 | 4.41,3.9 4.7,4.19 7.37,4.19 7.7,4.53 X1.5 7.7,8.18 7.32,8.55 U$5.1 | 2.4,2.78 2.16,2.54 v2.03,2.54 | C9.2 C2.2 15.85,21.74 15.24,22.35 12.32,22.35 11.92,22.75 U4.1 | C9.2 16.2,19.85 | v2.55,14.5 1.67,14.5 1.65,14.48 | v0.64,23.88 1.01,23.5 C10.2 | U$3.V- 10.7,25.5 11.47,24.73 U4.1 | U4.1 11.45,22.73 | C6.1 16.23,9.5 16.64,9.09 16.64,6.99 15.24,5.59 v15.08,5.59 | C21.2 36.07,14.35 35.65,14.77 U3.3 34.25,13.55 34.04,13.34 31.62,13.34 31.11,13.84 31.11,16 30.73,16.38 28.81,16.38 v28.5,16.69 28.19,16.38 26.67,16.38 23.2,19.85 U3.12 | v22.48,0.63 22.73,0.38 28.83,0.38 v29.08,0.63 29.33,0.38 31.88,0.38 32.75,1.25 S2.2 35.67,1.25 36.2,1.78 36.2,3.3 38.09,5.2 S1.2 | v31.5,26.42 v31.5,26.41 C5.2 31.5,24.26 31.24,24 U$2.2 | v31.5,26.42 31.68,26.6 J2.1 | v31.5,26.42 31.41,26.5 R1.2 29.35,27.29 29.08,27.56 25.91,27.56 25.35,27 C11.2 25.5,26.35 C4.2 25.05,24.85 v24.38,25.52 | Q5.2 13.47,13.45 13.21,13.72 13.21,15.11 13.53,15.43 | 13.53,15.43 13.6,15.5 R18.2 | 13.53,15.43 13.21,15.75 13.21,18.03 | C9.2 15.56,19.5 14.8,18.75 13.92,18.75 13.21,18.03 | 13.21,18.03 8.76,18.03 | v21,2.45 20.66,2.45 20.45,2.67 20.45,3.35 R7.2
  pour Top: 0,0 40,0 40,2.5 40,28.5 32.5,28.5 0,28.5
  pour Bottom: 0,0 40,0 40,28.5 0,28.5
  pour Route2: 0,0 40,0 40,28.5 0,28.5
GPS_EN  (via drill 0.35)
  Top 0.203: Q1.1 30.55,2.23 30.86,2.54 33.78,2.54 34,2.76 R28.1 34.92,3.35 v35.05,3.22 | U6.26 39.16,12.02 39.37,11.81 39.37,10.03 38.99,9.65 v38.61,9.65
  Bottom 0.203: v38.61,9.65 37.34,8.38 37.34,5.21 35.35,3.22 v35.05,3.22
GPS_RESET  (via drill 0.35)
  Top 0.203: v23.24,16.26 24.64,16.26 25.82,15.08 25.82,11.91 25.05,11.15 U6.16
  Bottom 0.203: v23.24,16.26 17.4,16.26 17.02,16.64 17.02,17.91 16.51,18.41 15.06,18.41 R17.2
IO0  (via drill 0.35)
  Top 0.203: R16.2 24.5,6.21 24.77,6.48 25.27,6.48 25.65,6.86 25.65,7.24 26.11,7.7 | v37.4,9.65 38,10.25 U6.25 | Q4.3 26.11,7.7 | 26.11,7.7 26.04,7.78 v26.04,8.22
  Bottom 0.203: v37.4,9.65 36.56,8.81 32.18,8.81 30.53,7.16 28.14,7.16 27.11,8.19 26.06,8.19 v26.04,8.22
MISO  (via drill 0.35)
  Top 0.203: U2.2 14,24.76 14.35,24.41 15.75,24.41 v16.13,24.03 | v36.32,18.41 37.95,18.41 U6.31
  Route2 0.203: v16.13,24.03 34.77,24.03 35.31,23.5 35.31,19.05 35.94,18.41 v36.32,18.41
MOSI  (via drill 0.35)
  Top 0.203: U2.3 12,24.73 12.7,24.03 14.86,24.03 v15.11,23.78 | U6.37 36.91,25.99 v34.29,23.37
  Route2 0.203: v15.11,23.78 15.52,23.37 v34.28,23.37 v34.29,23.37
MPU_INT  (via drill 0.35)
  Top 0.152: v18.67,13.59 18.67,12.57 19.22,12.02 U6.13
  Route15 0.152: v7.87,17.78 7.87,16.89 11.18,13.59 v18.67,13.59
  Bottom 0.152: U4.12 8.25,18.16 v7.87,17.78
N$1
  Bottom 0.406: X1.1 10.3,4.43 10.41,4.32 14.99,4.32 F4.1
N$2
  Bottom 0.203: Q5.3 16.7,14.54 16.93,14.77 U3.10
N$3
  Top 0.203: Q3.1 33.05,6.19 32.77,6.48 29.72,6.48 29.5,6.26 R13.1
N$4
  Top 0.203: Q4.1 26.05,4.68 26.29,4.45 30.3,4.45 R14.1
N$5  (via drill 0.35)
  Top 0.203: R2.1 14,6.83 14.35,6.48 16.63,6.48 16.89,6.73 16.89,7.23 17.1,7.45 U1.1 18.84,7.45 19.18,7.11 19.18,5.08 19.43,4.83 25.09,4.83 25.45,5.19 25.45,5.91 25.87,6.33 v26.09,6.33
  Bottom 0.203: D3.C 26.4,6.02 v26.09,6.33 26.09,6.66 26.42,6.99 27.81,6.99 28.14,6.66 31.7,6.66 32.4,5.95 Q6.2
N$6
  Bottom 0.203: R1.1 27.65,25.13 27.46,24.94 U$2.5
N$8
  Bottom 0.203: U4.8 10.25,19.04 10.41,18.87 12.27,18.87 12.57,19.18 12.57,20.7 13.37,21.5 C2.1
N$9
  Top 0.203: R2.2 14,4.92 14.22,4.7 14.86,4.7 17.65,4.7 17.82,4.86 U1.3
N$12
  Bottom 0.203: U4.10 9.25,18.69 9.53,18.41 12.45,18.41 13.53,19.5 C9.1
N$14  (via drill 0.35)
  Top 0.203: v4.45,23.5 4.45,23.37 5.6,22.21 v9.41,22.21
  Bottom 0.203: v4.45,23.5 C10.1 | U4.20 8.76,23.46 8.76,22.61 9.16,22.21 v9.41,22.21
N$15
  Bottom 0.203: F3.2
  Bottom 0.406: J2.2 35.5,23.81 35.81,23.5 F3.2
N$17
  Bottom 0.203: R12.1 19.01,26.5 18.8,26.29 18.8,24.04 D1.C
N$18
  Bottom 0.203: R17.1 R18.1 15.62,15.27 15.62,11.94 15.23,11.55 Q5.1
N$27
  Bottom 0.203: C16.1 3.77,13.5 4.91,12.37 U$5.4
NSS  (via drill 0.35)
  Top 0.203: R21.1 38.5,7.73 37.97,8.26 35.43,8.26 35.22,8.47 U6.24 35.18,9.79 v35.18,11.2 | U2.5 8,24.77 9.58,23.19 10.79,23.19 12.62,23.19 v12.83,22.99
  Route2 0.203: v12.83,22.99 15.62,20.19 18.8,20.19 18.92,20.19 33.53,20.19 34.04,19.68 34.04,18.16 35.18,17.02 v35.18,11.2
REED  (via drill 0.35)
  Top 0.152: v20.95,9.4 19.43,9.4 17.78,11.05 17.78,14.73 18.88,15.83 U6.10
  Bottom 0.203: R6.2 17.43,3.4 17.02,3.81 | 17.02,3.81 17.02,7.49 18.03,8.51 19.43,8.51 20.32,9.4 v20.95,9.4 | 17.02,3.81 16.38,3.81 15.9,3.33 S2.1
RFM_RST  (via drill 0.35)
  Top 0.203: U6.8 17.57,18.37 v17.14,18.8 | U2.6 6,24.35 7.49,22.86 11.94,22.86 12.95,21.84 16.87,21.84 v17.14,21.57
  Bottom 0.203: v17.14,18.8 v17.14,21.57
RTS  (via drill 0.35)
  Top 0.203: Q3.2 34.95,6.2 34.67,6.48 33.53,6.48 32.66,7.35 R14.2 31.5,8 31.28,8.22 v30.61,8.22
  Bottom 0.203: U$5.14 12.65,11.1 13.34,10.41 17.14,10.41 17.53,10.79 21.34,10.79 22.42,9.72 26.06,9.72 28.28,7.49 29.46,7.49 30.19,8.22 v30.61,8.22
RXD  (via drill 0.35)
  Top 0.203: U6.28 36.49,14.56 36.2,14.86 36.2,15.75 v36.32,15.88
  Bottom 0.203: v36.32,15.88 37.21,16.76 37.21,19.3 36.66,19.85 U3.1
SCK  (via drill 0.35)
  Top 0.203: U2.4 10,24.67 11.02,23.65 13.72,23.65 v13.97,23.4 | v36.32,17.14 36.37,17.1 U6.30
  Route2 0.203: v13.97,23.4 16.54,20.83 34.29,20.83 34.73,20.38 34.73,18.73 v36.32,17.14
SCL  (via drill 0.35)
  Top 0.203: U6.36 36.91,24.72 34.8,22.61 25.91,22.61 25.53,22.23 25.53,19.82 25.15,19.43 v24.89,19.43
  Route2 0.203: v10.54,21.34 12.44,19.43 v24.89,19.43
  Bottom 0.203: R5.1 6.85,24.7 7.33,24.21 9.95,24.21 10.25,23.91 U4.23 10.24,23.46 10.24,21.64 v10.54,21.34
SDA  (via drill 0.35)
  Top 0.203: v36.32,20.95 37.95,20.95 U6.33
  Bottom 0.203: R4.1 7.42,27.5 7.62,27.3 7.62,26.42 | U4.24 10.75,24.18 10.26,24.67 7.84,24.67 7.62,24.89 7.62,26.42 | 7.62,26.42 16.38,26.42 17.44,25.36 17.44,23.21 18.41,22.24 18.41,22.23 19.68,20.95 v36.32,20.95
SPANEL  (via drill 0.35)
  Route15 0.406: v0.64,27.3 0.64,25.4 1.14,24.89 19.18,24.89 20.83,23.24 20.83,12.95 22.23,11.56 v23.37,11.56 | v27.43,6.35 27.18,6.6 27.18,11.05 v26.67,11.56
  Bottom 0.406: v0.64,27.3 0.64,27.56 0.89,27.81 2.46,27.81 SJ1.1 | Q2.3 30.6,4.71 29.21,6.1 27.69,6.1 v27.43,6.35 | v26.67,11.56 v23.37,11.56
TXD  (via drill 0.35)
  Top 0.203: U6.27 32.81,13.29 32.38,13.72 v32.38,14.22
  Bottom 0.203: v32.38,14.22 32.38,17.02 32.68,17.31 U3.2
USB_N
  Bottom 0.203: X1.2 9.65,6.41 9.49,6.57 9.49,13.39 8.44,14.44 8.03,14.44 7.56,14.9 U$5.6
USB_P
  Bottom 0.203: X1.3 9,6.41 9.16,6.57 9.16,13.25 8.31,14.11 8.03,14.11 7.56,13.63 U$5.5
VBACKUP  (via drill 0.35)
  Route15 0.406: v24.13,27.69 37.34,27.69 37.85,27.18 37.85,11.3 v36.2,9.65
  Bottom 0.406: U$3.V+ 21.01,27.5 21.35,27.16 R12.2 C11.1 23.65,27.21 v24.13,27.69 | v36.2,9.65 34.29,9.65 U3.5
VBAT  (via drill 0.35)
  Route15 0.406: v33.93,5.59 34.29,5.95 34.29,19.09 v31.53,21.84
  Bottom 0.406: C5.1 32.98,23.15 F3.1 | U$2.3 31.41,23.06 C5.1 | v31.53,21.84 31.5,21.88 C5.1 | Q6.3 33.93,4.92 v33.93,5.59
X1
  Bottom 0.203: C15.1 3.43,15.5 | 3.43,15.5 4.07,15.5 4.75,16.18 U$5.7 | U5.P$1 1.7,16.46 1.78,16.38 3.17,16.38 3.43,16.13 3.43,15.5
X2
  Bottom 0.203: C14.1 3.35,19.65 U5.P$3 5.8,19.6 6.32,19.08 U$5.8

### Text on the board
tPlace: AMUCCA V1